# Altium schematic sheet X50328MSB2GI1_X50328MSB2GI.schdoc
size 127 x 101 mm
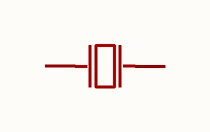
[diagram p0: X50328MSB2GI1_X50328MSB2GI.schdoc]

## Parts
X?  8MHz  [CRYSTAL-SMD_L5.0-W3.2]  (value not drawn)

## Nets

Not connected (* = marked no-connect by the designer): X? 1(OSC1) 2(OSC2)

## Library data of the parts
X? = X50328MSB2GI: Manufacturer: YXC(扬兴晶振); Add into BOM: yes; Normal temperature Frequency Tolerance: ±10ppm; Load Capacitance: 20pF; Frequency Stability: ±20ppm; Symbol: X50328MSB2GI; Device: X50328MSB2GI; LCSC Part Name: YSX530GA 8MHZ 2P 5032 20PF ±10PPM -40~85℃ (±20PPM); Supplier Part: C115962; Manufacturer Part: X50328MSB2GI; Supplier Footprint: SMD5032; JLCPCB Part Class: Basic Part; Datasheet: https://atta.szlcsc.com/upload/public/pdf/source/20240329/44922B0AF7B60E58E9B66993B6077277.pdf; Supplier: LCSC; Convert to PCB: yes; Type: Surface Mount Crystal; Value: 8MHz; Operating Temperature: -40℃~+85℃